# EAGLE design Irrigate4 (EAGLE 6.5.0)
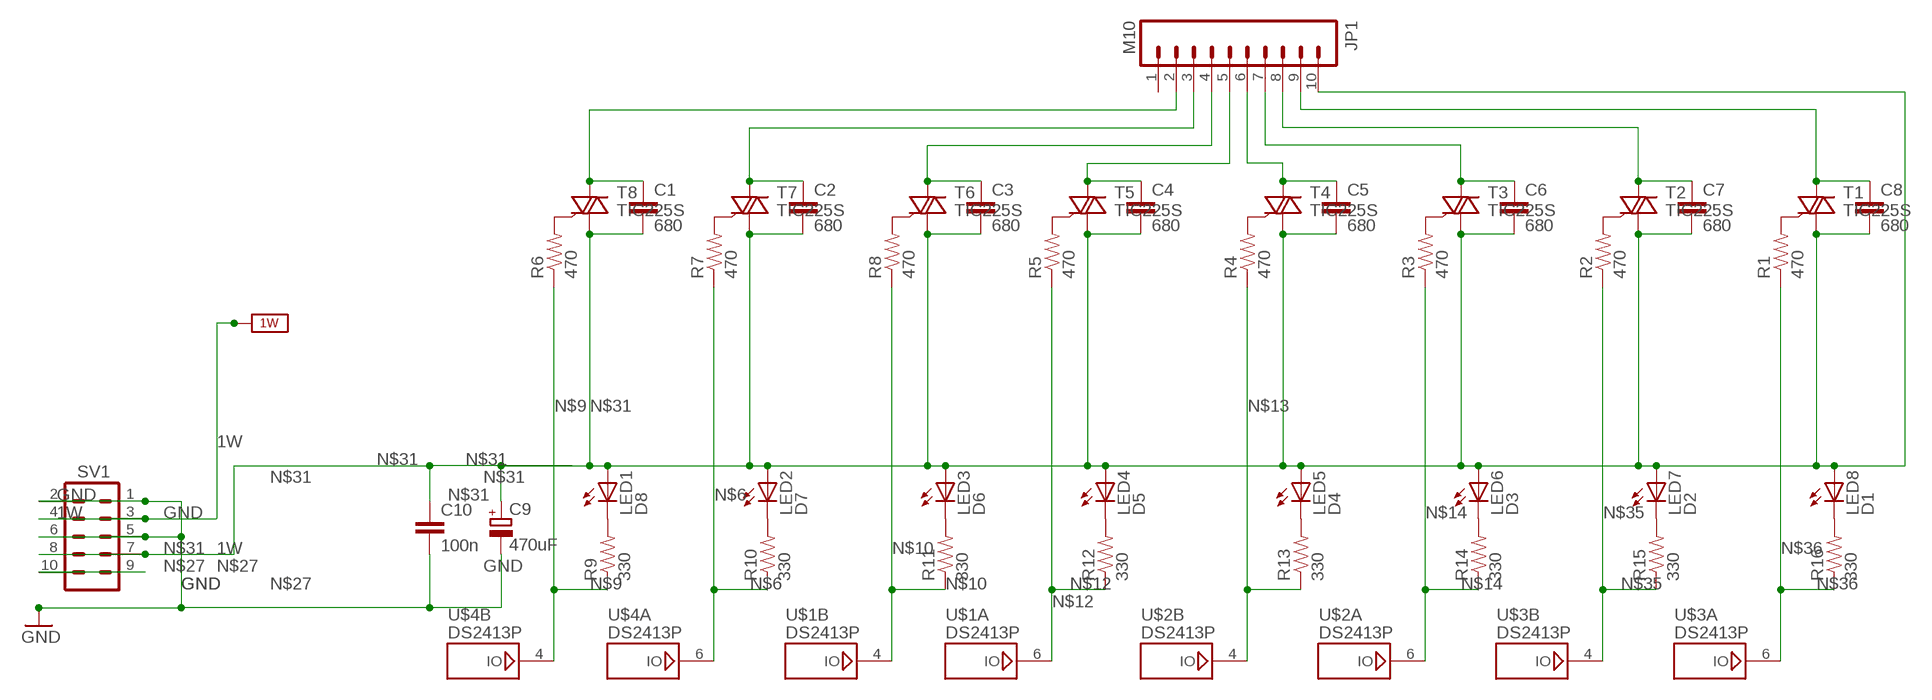
[diagram p0: schematic, sheet 1]

## Parts
C1  680  C-EU050-045X075  [C050-045X075]
C2  680  C-EU050-045X075  [C050-045X075]
C3  680  C-EU050-045X075  [C050-045X075]
C4  680  C-EU050-045X075  [C050-045X075]
C5  680  C-EU050-045X075  [C050-045X075]
C6  680  C-EU050-045X075  [C050-045X075]
C7  680  C-EU050-045X075  [C050-045X075]
C8  680  C-EU050-045X075  [C050-045X075]
C9  470uF  CPOL-EUE5-8.5  [E5-8,5]
C10  100n  C-EU050-024X044  [C050-024X044]
JP1  M10  [10X10MM]
LED1  D8  LED3MM  [LED3MM]
LED2  D7  LED3MM  [LED3MM]
LED3  D6  LED3MM  [LED3MM]
LED4  D5  LED3MM  [LED3MM]
LED5  D4  LED3MM  [LED3MM]
LED6  D3  LED3MM  [LED3MM]
LED7  D2  LED3MM  [LED3MM]
LED8  D1  LED3MM  [LED3MM]
R1  470  RESISTORPTH1  [AXIAL-0.3]
R2  470  RESISTORPTH1  [AXIAL-0.3]
R3  470  RESISTORPTH1  [AXIAL-0.3]
R4  470  RESISTORPTH1  [AXIAL-0.3]
R5  470  RESISTORPTH1  [AXIAL-0.3]
R6  470  RESISTORPTH1  [AXIAL-0.3]
R7  470  RESISTORPTH1  [AXIAL-0.3]
R8  470  RESISTORPTH1  [AXIAL-0.3]
R9  330  RESISTORPTH1  [AXIAL-0.3]
R10  330  RESISTORPTH1  [AXIAL-0.3]
R11  330  RESISTORPTH1  [AXIAL-0.3]
R12  330  RESISTORPTH1  [AXIAL-0.3]
R13  330  RESISTORPTH1  [AXIAL-0.3]
R14  330  RESISTORPTH1  [AXIAL-0.3]
R15  330  RESISTORPTH1  [AXIAL-0.3]
R16  330  RESISTORPTH1  [AXIAL-0.3]
SV1  M05X2PTH  [AVR_ICSP]
T1  TIC225S  [TO220DS]
T2  TIC225S  [TO220DS]
T3  TIC225S  [TO220DS]
T4  TIC225S  [TO220DS]
T5  TIC225S  [TO220DS]
T6  TIC225S  [TO220DS]
T7  TIC225S  [TO220DS]
T8  TIC225S  [TO220DS]
U$1  DS2413P  [TSOC6]
U$2  DS2413P  [TSOC6]
U$3  DS2413P  [TSOC6]
U$4  DS2413P  [TSOC6]

## Nets
1W: SV1.3 SV1.4 ; supply symbol labelled 1W_SUP
GND: C9.- C10.2 SV1.1 SV1.2 SV1.5 SV1.6
N$1: R1.P$2 T1.G
N$2: R2.P$2 T2.G
N$3: R3.P$2 T3.G
N$4: R4.P$2 T4.G
N$5: R5.P$2 T5.G
N$6: R7.P$1 R10.P$1 U$4.6
N$7: R7.P$2 T7.G
N$8: R6.P$2 T8.G
N$9: R6.P$1 R9.P$1 U$4.4
N$10: R8.P$1 R11.P$1 U$1.4
N$11: R8.P$2 T6.G
N$12: R5.P$1 R12.P$1 U$1.6
N$13: R4.P$1 R13.P$1 U$2.4
N$14: R3.P$1 R14.P$1 U$2.6
N$15: LED5.K(C) R13.P$2
N$16: LED6.K(C) R14.P$2
N$17: LED7.K(C) R15.P$2
N$18: C8.1 JP1.9 T1.A2
N$19: C7.1 JP1.8 T2.A2
N$20: C6.1 JP1.7 T3.A2
N$21: C5.1 JP1.6 T4.A2
N$22: C4.1 JP1.5 T5.A2
N$23: C3.1 JP1.4 T6.A2
N$24: C2.1 JP1.3 T7.A2
N$25: C1.1 JP1.2 T8.A2
N$26: LED8.K(C) R16.P$2
N$27: SV1.9 SV1.10
N$28: LED1.K(C) R9.P$2
N$29: LED2.K(C) R10.P$2
N$31: C1.2 C2.2 C3.2 C4.2 C5.2 C6.2 C7.2 C8.2 C9.+ C10.1 JP1.10 LED1.A LED2.A LED3.A LED4.A LED5.A LED6.A LED7.A LED8.A SV1.7 SV1.8 T1.A1 T2.A1 T3.A1 T4.A1 T5.A1 T6.A1 T7.A1 T8.A1
N$33: LED3.K(C) R11.P$2
N$34: LED4.K(C) R12.P$2
N$35: R2.P$1 R15.P$1 U$3.4
N$36: R1.P$1 R16.P$1 U$3.6
Unconnected: JP1.1

## Power pins joined to a net without a drawn wire
1W: U$1.2 U$2.2 U$3.2 U$4.2
GND: U$1.1 U$1.5 U$2.1 U$2.5 U$3.1 U$3.5 U$4.1 U$4.5

## Library data of the parts
C1-C8 C10 = rcl:C-EU: CAPACITOR, European symbol
C9 = rcl:CPOL-EU: POLARIZED CAPACITOR, European symbol
JP1 = robin:M10: Header 10 Standard 10-pin 0.1" header. Use with straight break away headers (SKU : PRT-00116), right angle break away headers (PRT-00553), swiss pins (PRT-00743), machine pins (PRT-00117), and female headers (PRT-00115).
LED1-LED8 = SparkFun:LED: LEDs Standard schematic elements and footprints for 5mm, 3mm, 1206, and 0603 sized LEDs. 5mm - Spark Fun Electronics SKU : COM-00529 (and others)
R1-R16 = SparkFun:RESISTOR: Resistor Basic schematic elements and footprints for 0603, 1206, and PTH 1/10th watt (small) resistors.
SV1 = SparkFun:M05X2: Header 5x2 Standard 10-pin dual row 0.1" header. Commonly used with AVR-ISP. Use with Spark Fun Electronics SKU: PRT-00778
T1-T8 = triac:TIC225S: TRIAC
U$1-U$4 = 1wire:DS2413: Dual Channel Addressable Switch This chip is similar to the DS2405 chip, but provides two PIO channels with 20mA sinking capability and an on-resistance of 20Ohm for each open drain output. Up to 28V can be switched. Note: Both GND pins must be connected to 0V. Author: Jan Kandziora <jjj@gmx.de>

## Board
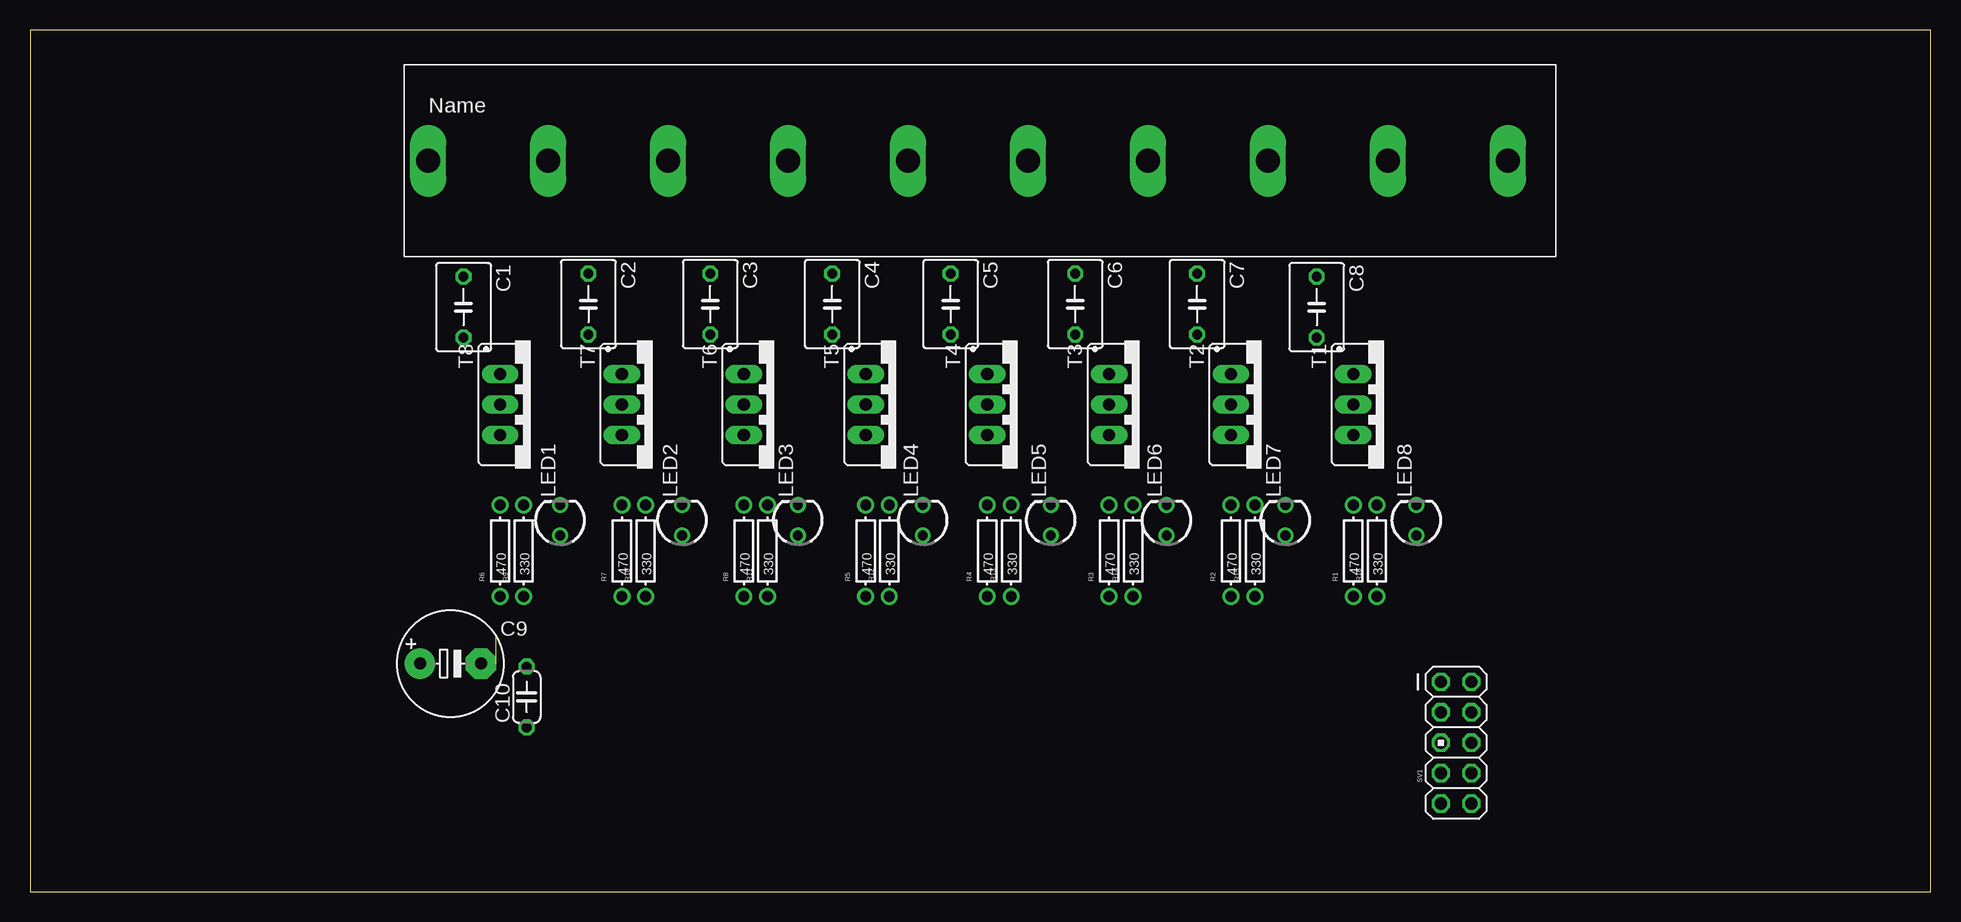
[diagram p1: board, top side]
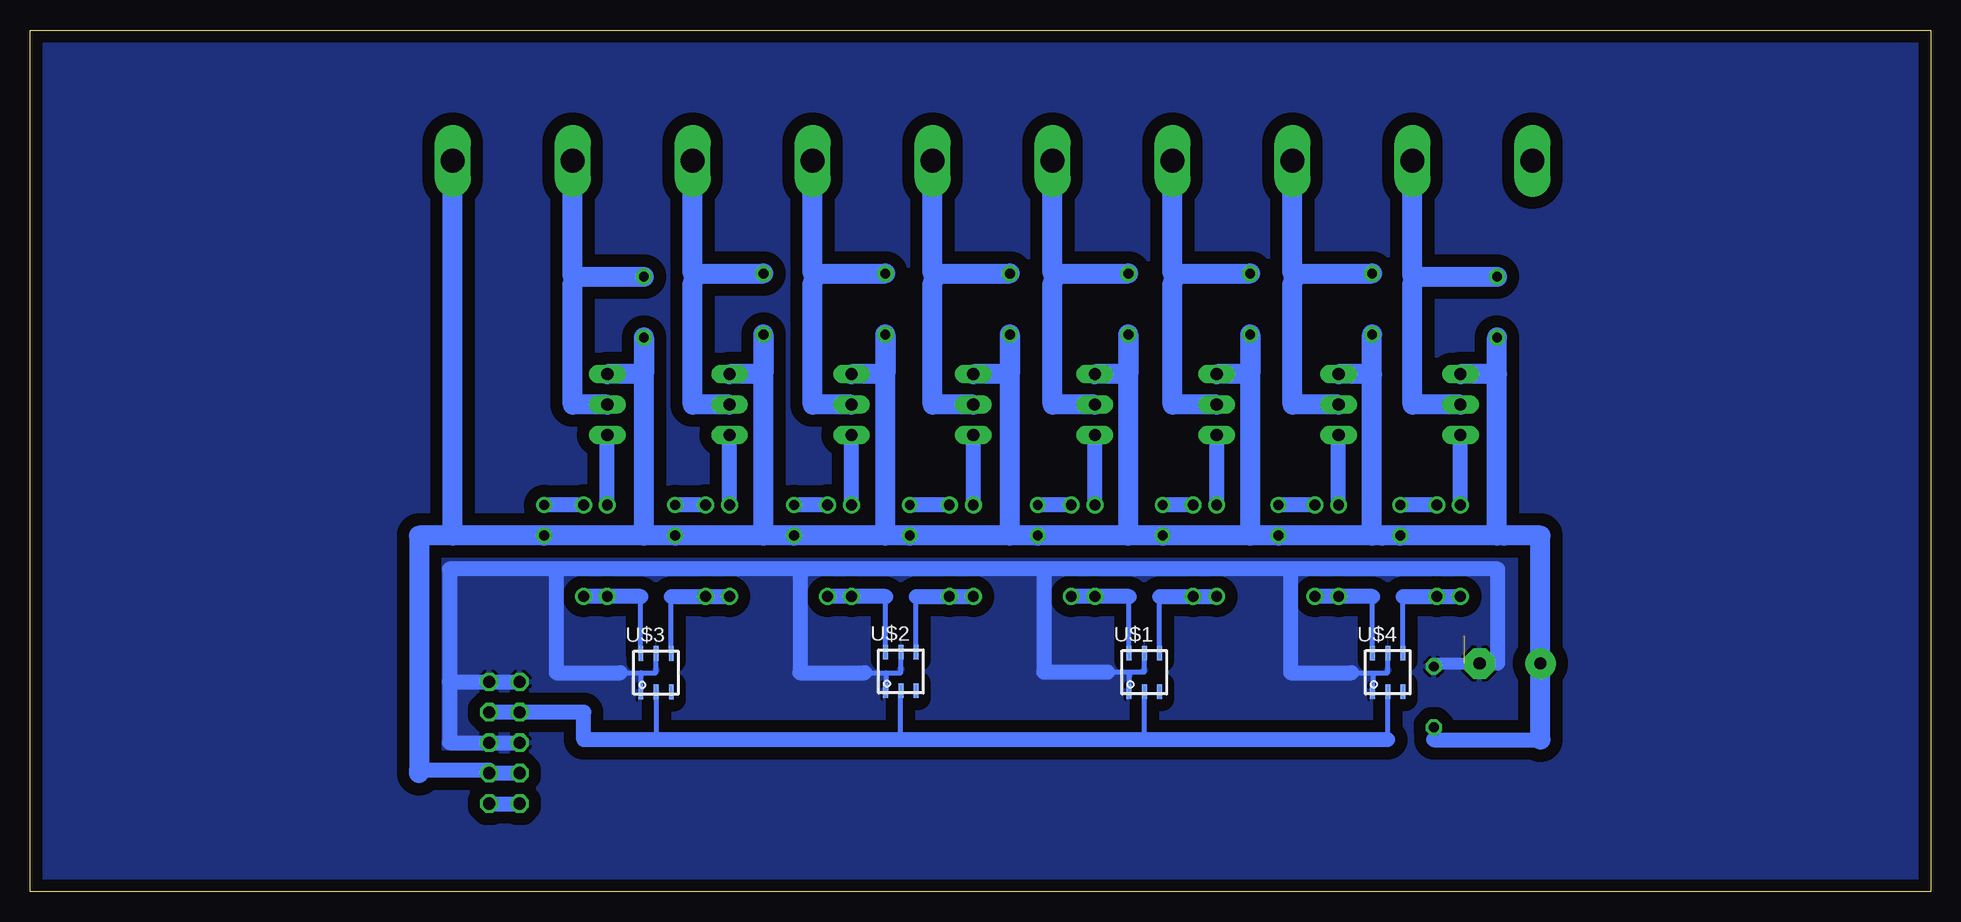
[diagram p2: board, bottom side, seen from below]

Size 158.42 x 71.87 mm. Coordinates in mm from the lower left corner, seen from the top.
Outline: 0,0 158.42,0 158.42,71.87 0,71.87 0,0
Copper layers (1*16): Top 0.035mm / dielectric 1.5mm / Bottom 0.035mm
Design rules "default": minimum track width 10mil, minimum drill 24mil, track to track 8mil, track to pad 8mil, pad to pad 8mil, via to via 8mil, smd to smd 8mil, copper to edge 40mil, drill to drill 8mil, minimum pad ring 10mil, minimum via ring 8mil, stop-mask expansion 4mil, vias tented up to drill 0mil, thermal gap 10mil

### Footprints (pad centres in the part's own frame; a part is rotated, then mirrored left to right if it is on the bottom)
C050-045X075 = drill 0.813 octagon: 1 -2.54,0; 2 2.54,0
E5-8,5 = drill 1.016 pad 2.54: + -2.54,0 | drill 1.016 pad 2.54 octagon: - 2.54,0
C050-024X044 = drill 0.813 octagon: 1 -2.54,0; 2 2.54,0
10X10MM = drill 2 long: 1 0,0; 2 10,0; 3 20,0; 4 30,0; 5 40,0; 6 50,0; 7 60,0; 8 70,0; 9 80,0; 10 90,0
LED3MM = drill 0.813: A -1.27,0; K 1.27,0
AXIAL-0.3 = drill 0.9: P$1 -3.81,0; P$2 3.81,0
AVR_ICSP = drill 1.016 octagon: 1 -1.27,5.08; 2 1.27,5.08; 3 -1.27,2.54; 4 1.27,2.54; 5 -1.27,0; 6 1.27,0; 7 -1.27,-2.54; 8 1.27,-2.54; 9 -1.27,-5.08; 10 1.27,-5.08
TO220DS = drill 1.016 long: A1 -2.54,-2.54; A2 0,-2.54; G 2.54,-2.54
TSOC6 = smd 0.406 x 1.219: 1 -1.27,-1.6; 2 0,-1.6; 3 1.27,-1.6; 4 1.27,1.6; 5 0,1.6; 6 -1.27,1.6

### Placement (x,y rotation side)
C1  36.13,48.77 270 top
C2  46.55,49.02 270 top
C3  56.71,49.02 270 top
C4  66.87,49.02 270 top
C5  76.74,49.02 270 top
C6  87.12,49.02 270 top
C7  97.28,49.02 270 top
C8  107.25,48.77 270 top
C9  35.05,19.05 0 top
C10  41.4,16.26 90 top
JP1  33.19,60.96 0 top
LED1  44.2,30.99 90 top
LED2  54.36,30.99 90 top
LED3  64.01,30.99 90 top
LED4  74.42,30.99 90 top
LED5  85.09,30.99 90 top
LED6  94.74,30.99 90 top
LED7  104.65,30.99 90 top
LED8  115.57,30.99 90 top
R1  110.3,28.45 90 top
R2  100.11,28.45 90 top
R3  89.95,28.45 90 top
R4  79.79,28.45 90 top
R5  69.66,28.45 90 top
R6  39.18,28.45 90 top
R7  49.34,28.45 90 top
R8  59.5,28.45 90 top
R9  41.15,28.45 90 top
R10  51.31,28.45 90 top
R11  61.47,28.45 90 top
R12  71.63,28.45 90 top
R13  81.79,28.45 90 top
R14  91.95,28.45 90 top
R15  102.11,28.45 90 top
R16  112.27,28.45 90 top
SV1  118.87,12.45 0 top
T1  112.84,40.64 270 top
T2  102.65,40.64 270 top
T3  92.49,40.64 270 top
T4  82.33,40.64 270 top
T5  72.2,40.64 270 top
T6  62.04,40.64 270 top
T7  51.88,40.64 270 top
T8  41.72,40.64 270 top
U$1  65.53,18.32 0 bottom
U$2  85.83,18.39 0 bottom
U$3  106.24,18.29 0 bottom
U$4  45.24,18.32 0 bottom

### Tracks (layer width: path | path; a pad name or v marks a point on that pad's centre or on a via)
1W
  Bottom 0.406: 45.24,12.7 U$4.2 | 65.53,12.7 U$1.2 | U$2.2 85.85,16.69 85.85,12.7 | U$3.2 106.17,16.69 106.17,12.7
  Bottom 1.27: 45.24,12.7 65.53,12.7 85.85,12.7 106.17,12.7 112.27,12.7 112.27,14.99 SV1.3 SV1.4
GND  (1 unrouted)
  Bottom 0.406: U$1.5 65.53,18.34 66.8,18.34 | 68.58,18.34 66.8,18.34 | U$2.5 85.83,18.29 87.07,18.29 | 88.85,18.29 87.07,18.29 | U$2.1 87.07,16.59 87.07,18.29 | U$3.5 106.24,18.29 107.51,18.29 | 109.22,18.29 107.51,18.29 | U$4.5 45.24,18.29 48.26,18.29 46.48,18.24 U$4.1 | 93.73,26.92 94.23,26.92 | 66.8,18.34 U$1.1 | 107.51,18.29 U$3.1 | 38.86,19.05 37.45,19.07 C9.- | C10.2 41.4,19.05
  Bottom 1.016: SV1.1 SV1.2 | 37.45,19.07 36.07,19.07 | 41.4,19.05 38.86,19.05
  Bottom 1.27: 53.34,26.92 36.07,26.92 36.07,19.07 | 53.34,26.92 73.91,26.92 | 114.55,26.92 93.73,26.92 73.91,26.92 | 68.58,18.34 73.91,18.34 73.91,26.92 | 48.26,18.29 53.34,18.29 53.34,26.92 | 88.85,18.29 94.23,18.29 94.23,26.92 | 109.22,18.29 114.55,18.29 114.55,26.92 | 114.55,26.92 123.44,26.92 123.44,17.53 | SV1.5 SV1.6 123.44,12.45 123.44,17.53 | 123.44,17.53 SV1.1
  pour Bottom (isolate 1.016): 0.51,71.37 157.99,71.37 157.99,0.25 0.51,0.25
N$1
  Bottom 1.27: R1.P$2 T1.G
N$2
  Bottom 1.27: R2.P$2 T2.G
N$3
  Bottom 1.27: R3.P$2 T3.G
N$4
  Bottom 1.27: R4.P$2 T4.G
N$5
  Bottom 1.27: R5.P$2 T5.G
N$6
  Bottom 0.406: U$4.6 46.51,24.64
  Bottom 1.27: 46.51,24.64 R7.P$1 R10.P$1
N$7
  Bottom 1.27: R7.P$2 T7.G
N$8
  Bottom 1.27: R6.P$2 T8.G
N$9
  Bottom 0.406: U$4.4 43.97,24.64
  Bottom 1.27: 43.97,24.64 R9.P$1 R6.P$1
N$10
  Bottom 0.406: U$1.4 64.26,24.64
  Bottom 1.27: 64.26,24.64 R11.P$1 R8.P$1
N$11
  Bottom 1.27: R8.P$2 T6.G
N$12
  Bottom 0.406: U$1.6 66.8,24.64
  Bottom 1.27: 66.8,24.64 R5.P$1 R12.P$1
N$13
  Bottom 0.406: U$2.4 84.56,24.64
  Bottom 1.016: R13.P$1 81.28,24.64
  Bottom 1.27: 84.56,24.64 R13.P$1 | 81.28,24.64 R4.P$1
N$14
  Bottom 0.406: U$2.6 87.1,24.64
  Bottom 1.27: 87.1,24.64 R3.P$1 R14.P$1
N$15
  Bottom 1.27: R13.P$2 LED5.K
N$16
  Bottom 1.27: R14.P$2 LED6.K
N$17
  Bottom 1.27: R15.P$2 LED7.K
N$18
  Bottom 1.016: 113.19,50.8 113.19,51.31
  Bottom 1.676: 113.19,50.8 113.19,40.64 T1.A2 | JP1.9 113.19,51.31 C8.1
N$19
  Bottom 1.016: 103.19,50.8 103.19,51.56
  Bottom 1.676: 103.19,50.8 103.19,40.64 T2.A2 | JP1.8 103.19,51.56 C7.1
N$20
  Bottom 1.016: 93.19,50.8 93.19,51.56
  Bottom 1.676: 93.19,50.8 93.19,40.64 T3.A2 | JP1.7 93.19,51.56 C6.1
N$21
  Bottom 1.016: 83.19,50.8 83.19,51.56
  Bottom 1.676: 83.19,50.8 83.19,40.64 T4.A2 | JP1.6 83.19,51.56 C5.1
N$22
  Bottom 1.016: 73.19,50.8 73.19,51.56
  Bottom 1.676: 73.19,50.8 73.19,40.64 T5.A2 | JP1.5 73.19,51.56 C4.1
N$23
  Bottom 1.016: 63.19,50.8 63.19,51.56
  Bottom 1.676: 63.19,50.8 63.19,40.64 T6.A2 | JP1.4 63.19,51.56 C3.1
N$24
  Bottom 1.016: 53.19,50.8 53.19,51.56
  Bottom 1.676: 53.19,50.8 53.19,40.64 T7.A2 | JP1.3 53.19,51.56 C2.1
N$25
  Bottom 1.016: 43.19,50.8 43.19,51.31
  Bottom 1.676: 43.19,50.8 43.19,40.64 T8.A2 | JP1.2 43.19,51.31 C1.1
N$26
  Bottom 1.27: R16.P$2 LED8.K
N$27
  Bottom 1.27: SV1.10 SV1.9
N$28
  Bottom 1.27: R9.P$2 LED1.K
N$29
  Bottom 1.27: R10.P$2 LED2.K
N$31
  Bottom 0.358: 35.56,29.72 36.13,29.72 | 45.72,29.72 46.55,29.72
  Bottom 0.406: SV1.8 120.14,10.16 | C10.1 41.4,12.7
  Bottom 1.27: SV1.7 SV1.8 | 120.14,10.16 125.98,10.16 | 41.4,12.7 32.51,12.7
  Bottom 1.676: T6.A1 56.71,43.18 C3.2 56.71,29.72 | T5.A1 66.87,43.18 C4.2 66.87,29.72 | T4.A1 76.74,43.18 C5.2 76.74,29.72 | T3.A1 87.12,43.18 C6.2 87.12,29.72 | T2.A1 97.28,43.18 C7.2 97.28,29.72 | 123.19,29.72 JP1.10 | 107.25,29.72 LED8.A 123.19,29.72 | 56.71,29.72 LED2.A 45.72,29.72 LED1.A 35.56,29.72 32.51,29.72 C9.+ 32.51,12.7 | 56.71,29.72 LED3.A 66.87,29.72 | 76.74,29.72 LED4.A 66.87,29.72 | 76.74,29.72 LED5.A 87.12,29.72 | 87.12,29.72 LED6.A 97.28,29.72 | 107.25,29.72 C8.2 107.25,43.18 T1.A1 | 97.28,29.72 LED7.A 107.25,29.72 | 125.98,9.91 125.98,10.16 125.98,29.72 123.19,29.72 | 36.13,29.72 36.13,43.18 | 36.13,43.18 C1.2 | 36.13,43.18 T8.A1 | 46.55,29.72 46.55,43.18 | 46.55,43.18 C2.2 | 46.55,43.18 T7.A1
N$33
  Bottom 1.27: R11.P$2 LED3.K
N$34
  Bottom 1.27: R12.P$2 LED4.K
N$35
  Bottom 0.406: U$3.4 104.97,24.64
  Bottom 1.27: 104.97,24.64 R15.P$1 R2.P$1
N$36
  Bottom 0.406: U$3.6 107.51,24.64
  Bottom 1.27: 107.51,24.64 R1.P$1 R16.P$1